# Altium schematic sheet IO.SchDoc
size 292 x 203 mm; SheetNumber: 3; SheetTotal: 6
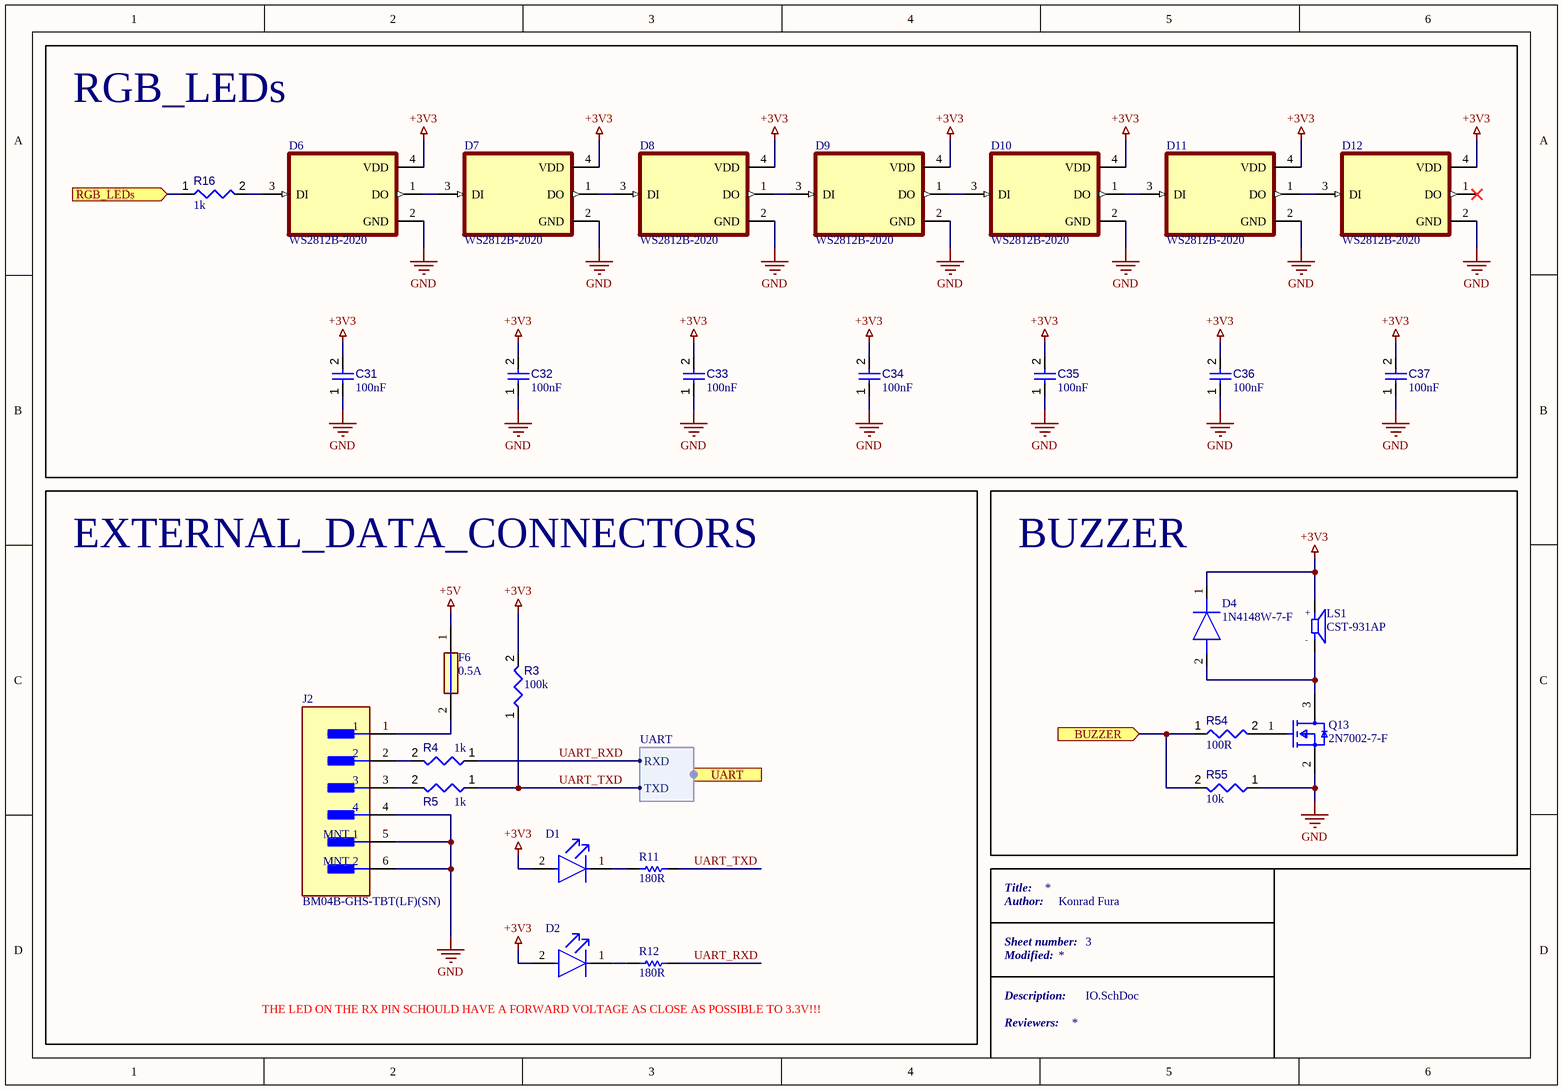
[diagram p0: IO.SchDoc]

## Parts
C31  value 100nF  [CAPC0402(1005)60_L]  (hidden comment: Capacitor 100nF +/-20% 10V 0402)
C32  value 100nF  [CAPC0402(1005)60_L]  (hidden comment: Capacitor 100nF +/-20% 10V 0402)
C33  value 100nF  [CAPC0402(1005)60_L]  (hidden comment: Capacitor 100nF +/-20% 10V 0402)
C34  value 100nF  [CAPC0402(1005)60_L]  (hidden comment: Capacitor 100nF +/-20% 10V 0402)
C35  value 100nF  [CAPC0402(1005)60_L]  (hidden comment: Capacitor 100nF +/-20% 10V 0402)
C36  value 100nF  [CAPC0402(1005)60_L]  (hidden comment: Capacitor 100nF +/-20% 10V 0402)
C37  value 100nF  [CAPC0402(1005)60_L]  (hidden comment: Capacitor 100nF +/-20% 10V 0402)
D1  (no value)  [FP-LTST-C191TBKT-MFG]
D2  (no value)  [FP-LTST-C191TBKT-MFG]
D4  1N4148W-7-F  [SOD3716X145N]
D6  WS2812B-2020  [LED_WS2812-2020]
D7  WS2812B-2020  [LED_WS2812-2020]
D8  WS2812B-2020  [LED_WS2812-2020]
D9  WS2812B-2020  [LED_WS2812-2020]
D10  WS2812B-2020  [LED_WS2812-2020]
D11  WS2812B-2020  [LED_WS2812-2020]
D12  WS2812B-2020  [LED_WS2812-2020]
F6  0.5A  [FUSC2114X75N]
J2  BM04B-GHS-TBT(LF)(SN)  [FP-BM04B-GHS-TBT_LF_SN-MFG]
LS1  CST-931AP  [CUI_CST-931AP]
Q13  2N7002-7-F  [FP-SOT23-MFG]
R3  value 100k  [RESC0402(1005)_L]  (hidden comment: Resistor 100K +/-1 % 0402 63 mW)
R4  value 1k  [RESC0402(1005)_L]  (hidden comment: Resistor 1K +/-5 % 0402 63 mW)
R5  value 1k  [RESC0402(1005)_L]  (hidden comment: Resistor 1K +/-5 % 0402 63 mW)
R11  180R  [RESC1005X40X25NL05T05]
R12  180R  [RESC1005X40X25NL05T05]
R16  value 1k  [RESC0402(1005)_L]  (hidden comment: Resistor 1K +/-5 % 0402 63 mW)
R54  value 100R  [RESC0402(1005)_L]  (hidden comment: Resistor 100R +/-1 % 0402 63 mW)
R55  value 10k  [RESC0402(1005)_L]  (hidden comment: Resistor 10K  +/-1 % 0402 63 mW)

## Blocks framed on the sheet
RGB_LEDs: C31-C37 D6-D12 R16
EXTERNAL_DATA_CONNECTORS: D1 D2 F6 J2 R3-R5 R11 R12
BUZZER: D4 LS1 Q13 R54 R55

## Ports
BUZZER (in, see SYSTEM_OVERVIEW[3C], MCU[6A]), RGB_LEDs (in, see SYSTEM_OVERVIEW[3C], MCU[6A]), UART (harness UART, see SYSTEM_OVERVIEW[3C], MCU[3B])

## Harnesses
UART: RXD, TXD

## Nets
+3V3: C31.2 C32.2 C33.2 C34.2 C35.2 C36.2 C37.2 D1.2(A) D2.2(A) D4.1(K) D6.4(VDD) D7.4(VDD) D8.4(VDD) D9.4(VDD) D10.4(VDD) D11.4(VDD) D12.4(VDD) LS1.P R3.2
+5V: F6.1
GND: C31.1 C32.1 C33.1 C34.1 C35.1 C36.1 C37.1 D6.2(GND) D7.2(GND) D8.2(GND) D9.2(GND) D10.2(GND) D11.2(GND) D12.2(GND) J2.4 J2.5(MNT_1) J2.6(MNT_2) Q13.2(S) R55.1
BUZZER: R54.1 R55.2 ; port BUZZER
RGB_LEDs: R16.1 ; port RGB_LEDs
UART_RXD: R4.1 R12.2 ; port UART.RXD
UART_TXD: R3.1 R5.1 R11.2 ; port UART.TXD
NetD1_1: D1.1(C) R11.1
NetD2_1: D2.1(C) R12.1
NetD4_2: D4.2(A) LS1.M Q13.3(D)
NetD6_1: D6.1(DO) D7.3(DI)
NetD6_3: D6.3(DI) R16.2
NetD7_1: D7.1(DO) D8.3(DI)
NetD8_1: D8.1(DO) D9.3(DI)
NetD9_1: D9.1(DO) D10.3(DI)
NetD10_1: D10.1(DO) D11.3(DI)
NetD11_1: D11.1(DO) D12.3(DI)
NetF6_2: F6.2 J2.1
NetJ2_2: J2.2 R4.2
NetJ2_3: J2.3 R5.2
NetQ13_1: Q13.1(G) R54.2

Not connected (* = marked no-connect by the designer): D12 1(DO)*

## Notes on the sheet
- Title:
- Author:
- Konrad Fura
- Sheet number:
- Modified:
- THE LED ON THE RX PIN SCHOULD HAVE A FORWARD VOLTAGE AS CLOSE AS POSSIBLE TO 3.3V!!!
- Description:
- Reviewers:
- (in symbol CST-931AP) +; -

## Library data of the parts
C31-C37 = CMP-001-00061-3: Chip Capacitor, 100nF +/-20%, 10V, 0402, Thickness 0.6 mm; Tolerance: 20%; Mounting Technology: SMT; Voltage Rating: 10V; Max Operating Temperature: 85°C; Pins: 2; Case/Package: 0402; Min Operating Temperature: -55°C
D1 D2 = CMP-22017-000008-1: LED BLUE CLEAR CHIP SMD; Lens Color: Colorless; Dominant Wavelength: 475nm; Forward Current: 20mA; Wavelength: 468nm; Viewing Angle: 130°; Power Dissipation: 76mW; Luminous Intensity: 180mcd; Reverse Voltage: 5V; Number of Elements: 1; Lens Style: Diffused; Forward Voltage: 3.8V; Max Power Dissipation: 75mW; Case Code (Metric): 1608; Packaging: Tape and Reel; Case/Package: 0603; Depth: 1.6mm; Mount: Surface Mount; Lead Free: Lead Free; Min Operating Temperature: -20°C; Lens Transparency: Clear; Illumination Color: Blue; Height: 0.55mm; Test Current: 20mA; Case Code (Imperial): 0603; Max Operating Temperature: 80°C; Number of Pins: 2; Length: 0.8mm; Radiation Hardening: No; Package Quantity: 1; Number of LEDs: 1; Width: 0.8mm; Color: Blue
D4 = 1N4148W-7-F: Diode; Manufacturer_Name: Diodes Inc.; Datasheet Link: https://componentsearchengine.com/Datasheets/2/1N4148W-7-F.pdf; Height: 1.45mm; Manufacturer_Part_Number: 1N4148W-7-F; Mouser Part Number: 621-1N4148W-F; Mouser Price/Stock: https://www.mouser.co.uk/ProductDetail/Diodes-Incorporated/1N4148W-7-F?qs=LHX0FizJzg7Ae9ZM8LTAWw%3D%3D; Arrow Part Number: 1N4148W-7-F; Arrow Price/Stock: https://www.arrow.com/en/products/1n4148w-7-f/diodes-incorporated?region=europe
D6-D12 = WS2812-2020: Intelligent control LED integrated light source; MF: {'manufacturer': u'Worldsemi'}; Availability: Unavailable; Value: *; Package: None; Price: None; MP: WS2812-2020
F6 = 0805L020_24YR: Fuse; Manufacturer_Name: LITTELFUSE; Manufacturer_Part_Number: 0805L020/24YR; Datasheet Link: https://m.littelfuse.com/media?resourcetype=datasheets&itemid=3b1fa5dc-24aa-4363-b543-edb057c2fffa&filename=littelfuse-ptc-0805l-datasheet; Height: 0.75mm; Mouser Part Number: 576-0805L020/24YR; Mouser Price/Stock: https://www.mouser.co.uk/ProductDetail/Littelfuse/0805L020-24YR?qs=AQlKX63v8Rtx0r%252BHTgklTQ%3D%3D
J2 = CMP-17439-000062-2: CONN HEADER SMD 4POS 1.25MM; Number of Positions: 4; Wire/Cable Gauge: 26AWG; Current Rating: 1A; Voltage Rating (AC): 50V; Gender: Male; Orientation: Straight; Max Operating Temperature: 85°C; Pitch: 1.25mm; Contact Plating: Tin; Number of Rows: 4; Series: GH; Min Operating Temperature: -25°C; REACH SVHC: No SVHC; Packaging: Cut Tape; Lead Free: Lead Free; Voltage Rating: 50V; Contact Material: Bronze; Number of Contacts: 4; Termination: Crimp; Case/Package: SMD/SMT; Housing Color: Natural; Housing Material: Nylon
LS1 = CST-931AP: 9 mm, 3 V, 85 dB, Through Hole, Magnetic Audio Transducer Buzzer; MF: {'manufacturer': u'CUI Devices'}; Package: None; Price: None; Value: *; MP: CST-931AP; Availability: Unavailable
Q13 = CMP-2000-04929-2: MOSFET N-CH 60V 115MA SOT23-3; Turn-On Delay Time: 7ns; Turn-Off Delay Time: 11ns; Drain to Source Resistance: 7.5R; Rise Time: 3ns; Drain to Source Breakdown Voltage: 70V; Input Capacitance: 50pF; Number of Elements: 1; Power Dissipation: 540mW; Max Power Dissipation: 300mW; Fall Time: 5.6ns; Gate to Source Voltage (Vgs): 20V; Threshold Voltage: 2.5V; Element Configuration: Single; Termination: SMD/SMT; Weight: 0.000282oz; Radiation Hardening: No; Max Operating Temperature: 150°C; On-State Resistance: 7.5R; Mount: Surface Mount; Current Rating: 115mA; Contact Plating: Tin; Lead Free: Lead Free; Min Operating Temperature: -55°C; Number of Pins: 3; REACH SVHC: No SVHC; Drain to Source Voltage (Vdss): 60V; Width: 1.3mm; Package Quantity: 3000; Length: 2.9mm; Case/Package: SOT-23; Number of Channels: 1; Dual Supply Voltage: 60V; Packaging: Tape and Reel; Height: 1mm; Voltage Rating (DC): 60V; Nominal Vgs: 2.5V; Continuous Drain Current (ID): 115mA; Voltage: 60V; Rds On Max: 7.5R
R3 = CMP-009-00168-3: Chip Resistor, 100 kOhms, +/-1 %, 63 mW, -55 to 155 degC, 0402; Tolerance: 1%; Power: 63mW; Max Operating Temperature: 155°C; Min Operating Temperature: -55°C; Pins: 2; Case/Package: 0402
R4 R5 R16 = CMP-009-00157-3: Chip Resistor, 1 kOhms, +/-5 %, 63 mW, -55 to 155 degC, 0402; Tolerance: 5%; Power: 63mW; Case/Package: 0402; Pins: 2; Min Operating Temperature: -55°C; Max Operating Temperature: 155°C
R11 R12 = CMP-2002-01127-1: Manufacturer: Panasonic; Part Number: ERJ2RKF1800X
R54 = CMP-009-00167-3: Chip Resistor, 100 Ohms, +/-1 %, 63 mW, -55 to 155 degC, 0402; Power: 63mW; Tolerance: 1%; Min Operating Temperature: -55°C; Case/Package: 0402; Pins: 2; Max Operating Temperature: 155°C
R55 = CMP-009-00149-3: Chip Resistor, 10 kOhms, +/-1 %, 63 mW, -55 to 125 degC, 0402; Power: 63mW; Tolerance: 1%; Min Operating Temperature: -55°C; Case/Package: 0402; Max Operating Temperature: 155°C; Pins: 2